# EAGLE design SCH Basis (EAGLE 9.6.2)
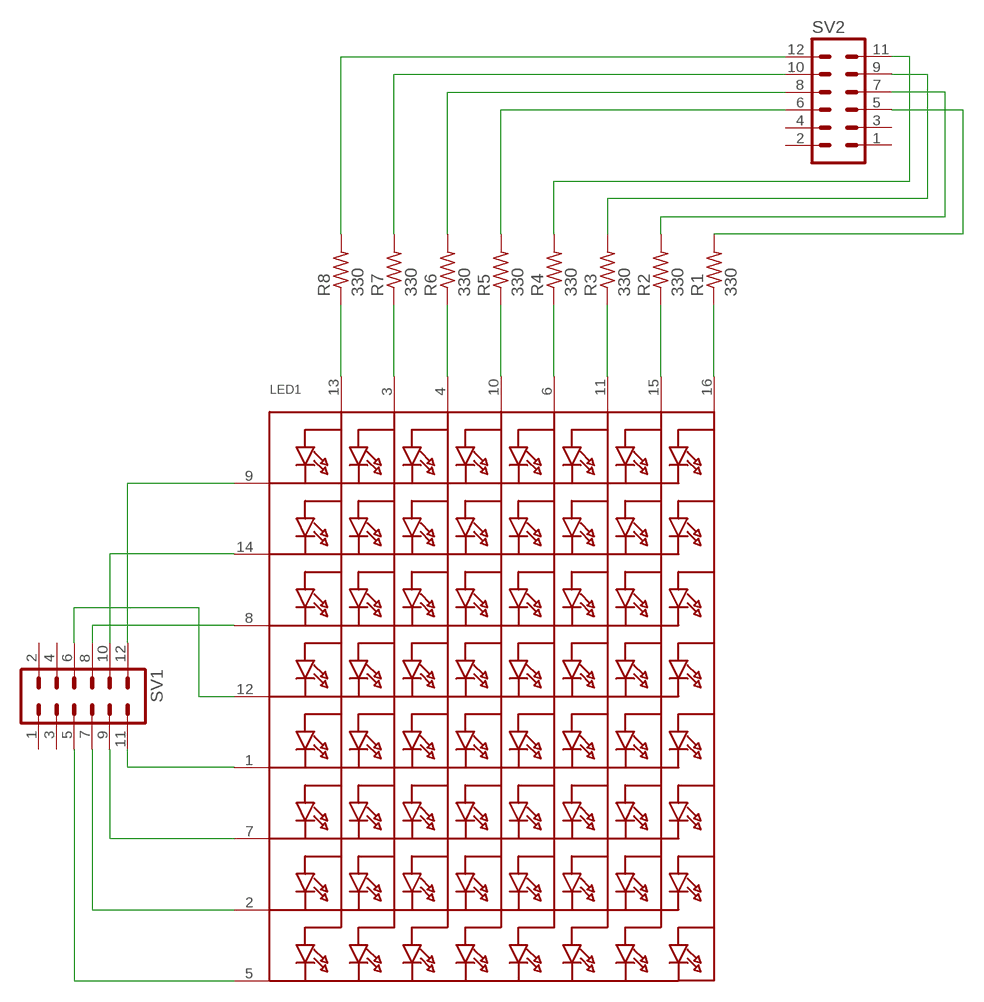
[diagram p0: schematic, sheet 1]

## Parts
LED1  SEGMENT_8X8_ROWCATHODEM12A881UR  [SEGMENT_BL-M12A881UR]
R1  330  R-US_0207/9  [0207/9]
R2  330  R-US_0207/9  [0207/9]
R3  330  R-US_0207/9  [0207/9]
R4  330  R-US_0207/9  [0207/9]
R5  330  R-US_0207/9  [0207/9]
R6  330  R-US_0207/9  [0207/9]
R7  330  R-US_0207/9  [0207/9]
R8  330  R-US_0207/9  [0207/9]
SV1  MA06-2  [MA06-2]
SV2  MA06-2  [MA06-2]

## Nets
N$1: LED1.13(A1) R8.1
N$2: LED1.3(A2) R7.1
N$3: LED1.4(A3) R6.1
N$4: LED1.10(A4) R5.1
N$5: LED1.6(A5) R4.1
N$6: LED1.11(A6) R3.1
N$7: LED1.15(A7) R2.1
N$8: LED1.16(A8) R1.1
N$9: R8.2 SV2.12
N$10: R7.2 SV2.10
N$11: R6.2 SV2.8
N$12: R5.2 SV2.6
N$13: R4.2 SV2.11
N$14: R3.2 SV2.9
N$15: R2.2 SV2.7
N$16: R1.2 SV2.5
N$17: LED1.9(K1) SV1.12
N$18: LED1.14(K2) SV1.10
N$19: LED1.8(K3) SV1.8
N$20: LED1.12(K4) SV1.6
N$21: LED1.1(K5) SV1.11
N$22: LED1.7(K6) SV1.9
N$23: LED1.2(K7) SV1.7
N$24: LED1.5(K8) SV1.5
Unconnected: SV1.1 SV1.2 SV1.3 SV1.4 SV2.1 SV2.2 SV2.3 SV2.4

## Library data of the parts
LED1 = adafruit:SEGMENT_8X8_ROWCATHODE: 8x8 LED Segment Displays: Row = Cathode 0.7" Red 8X8 Matrix, 1.9mm Round LEDs - BL-M07C881UR 1.2" Red 8x8 Matrix, 3.0mm Round LEDs - BL-M12A881UR 1.2" Red 8x8 Matrix, 3.0mm Square LEDs - BL-M12A883
R1-R8 = adafruit:R-US_: RESISTOR, American symbol
SV1 SV2 = con-lstb:MA06-2: PIN HEADER; OC_FARNELL: unknown; OC_NEWARK: unknown

## Board
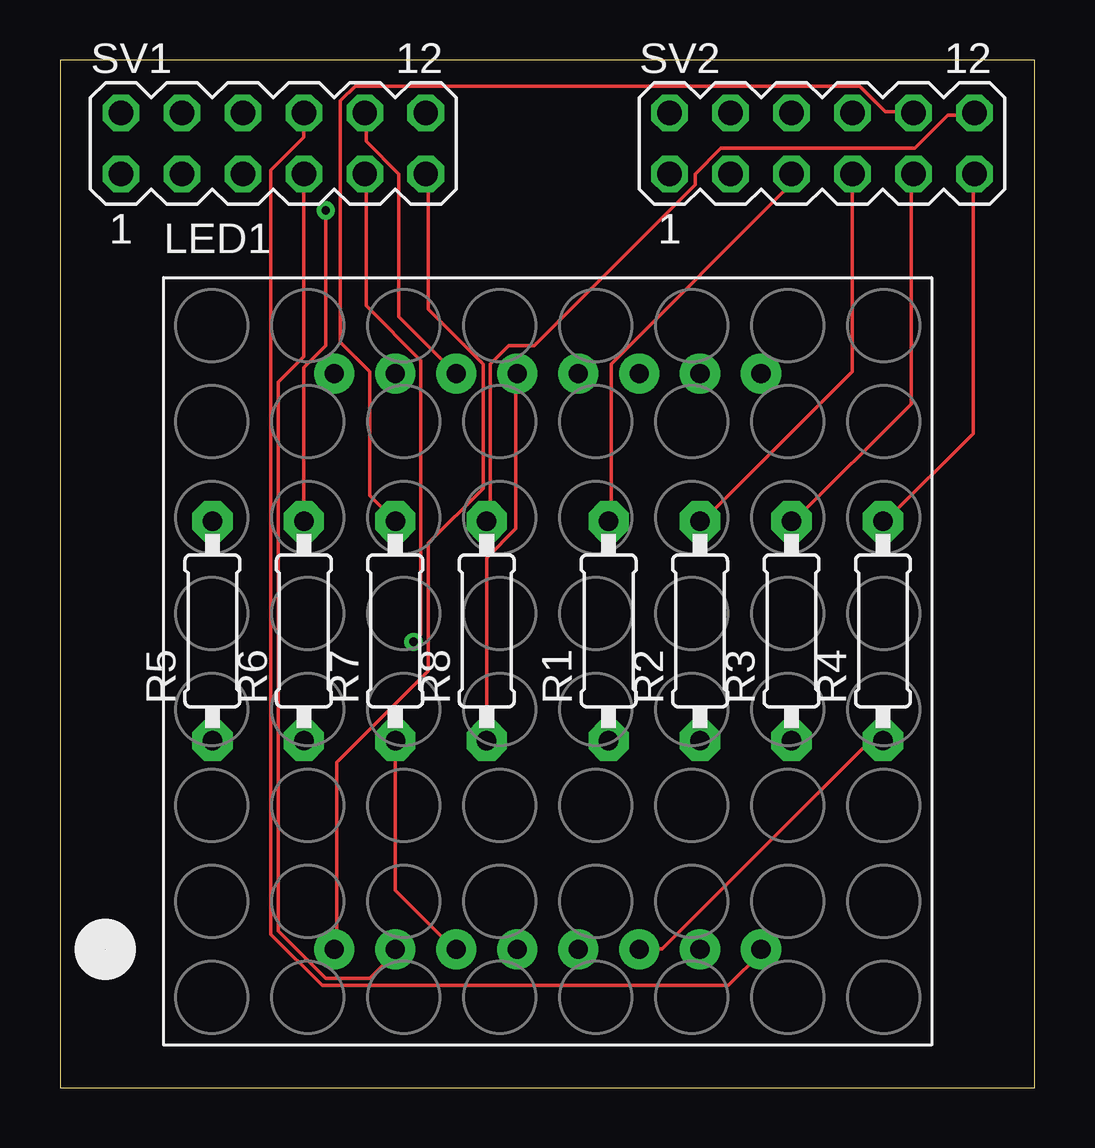
[diagram p1: board, top side]
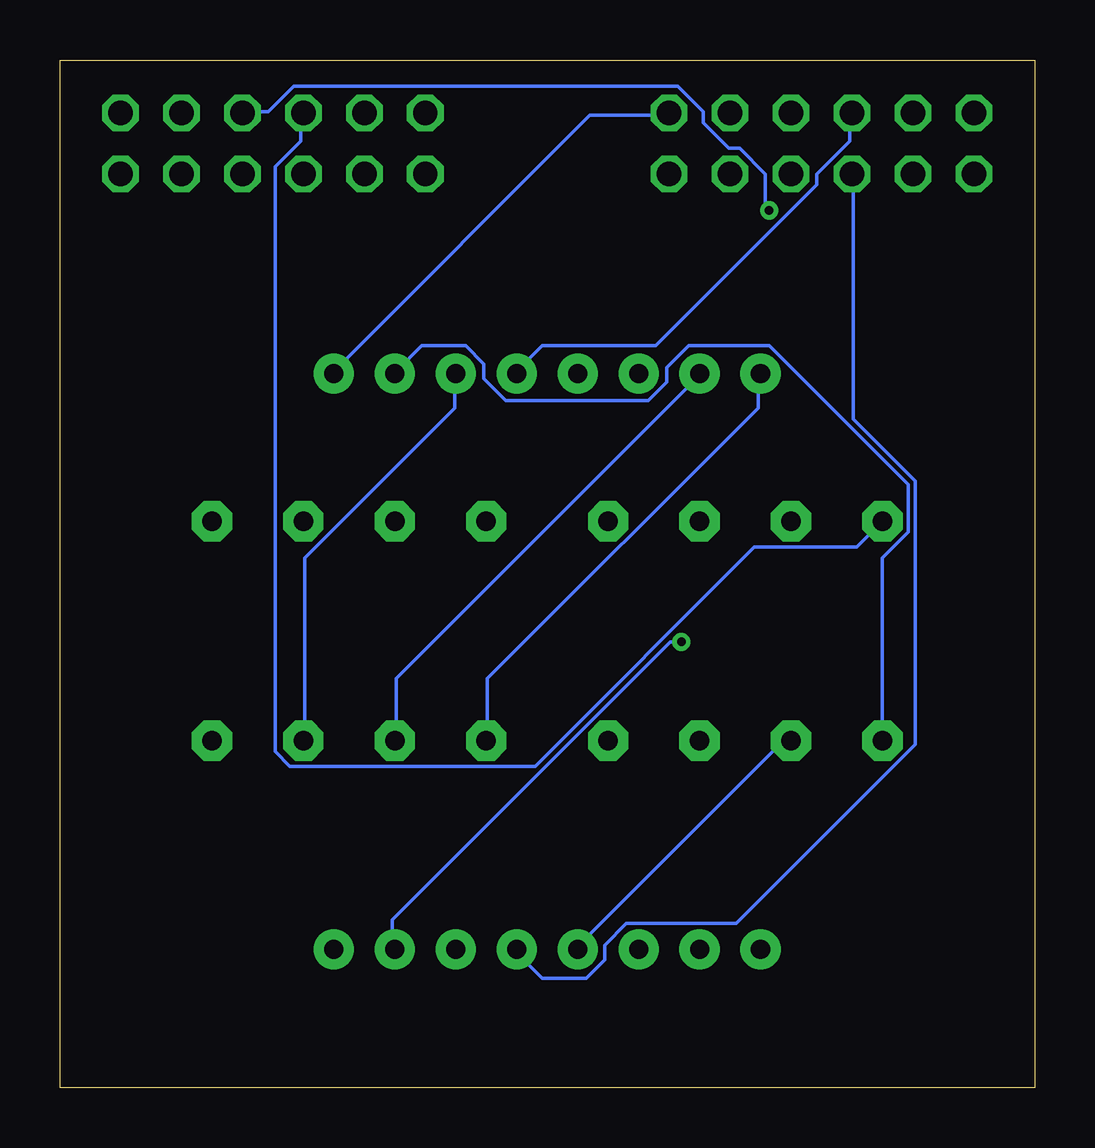
[diagram p2: board, bottom side, seen from below]

Size 40.62 x 42.85 mm. Coordinates in mm from the lower left corner, seen from the top.
Outline: 0,0 40.62,0 40.62,42.85 0,42.85 0,0
Copper layers (1*16): Top 0.035mm / dielectric 1.5mm / Bottom 0.035mm
Design rules "default": minimum track width 6mil, minimum drill 0.35mm, track to track 6mil, track to pad 6mil, pad to pad 6mil, via to via 6mil, smd to smd 6mil, copper to edge 40mil, drill to drill 6mil, minimum pad ring 10mil, minimum via ring 8mil, stop-mask expansion 4mil, vias tented up to drill 0mil, thermal gap 10mil

### Footprints (pad centres in the part's own frame; a part is rotated, then mirrored left to right if it is on the bottom)
SEGMENT_BL-M12A881UR = drill 0.8 pad 1.676: 1 -8.89,-12; 2 -6.35,-12; 3 -3.81,-12; 4 -1.27,-12; 5 1.27,-12; 6 3.81,-12; 7 6.35,-12; 8 8.89,-12; 9 8.89,12; 10 6.35,12; 11 3.81,12; 12 1.27,12; 13 -1.27,12; 14 -3.81,12; 15 -6.35,12; 16 -8.89,12
0207/9 = drill 0.813 pad 1.676 octagon: 1 -4.572,0; 2 4.572,0
MA06-2 = drill 1.016 octagon: 1 -6.35,-1.27; 2 -6.35,1.27; 3 -3.81,-1.27; 4 -3.81,1.27; 5 -1.27,-1.27; 6 -1.27,1.27; 7 1.27,-1.27; 8 1.27,1.27; 9 3.81,-1.27; 10 3.81,1.27; 11 6.35,-1.27; 12 6.35,1.27

### Placement (x,y rotation side)
LED1  20.32,17.78 0 top
R1  22.86,19.05 90 top
R2  26.67,19.05 90 top
R3  30.48,19.05 90 top
R4  34.29,19.05 90 top
R5  6.35,19.05 90 top
R6  10.16,19.05 90 top
R7  13.97,19.05 90 top
R8  17.78,19.05 90 top
SV1  8.89,39.37 0 top
SV2  31.75,39.37 0 top

### Tracks (layer width: path | path; a pad name or v marks a point on that pad's centre or on a via)
N$1
  Top 0.152: 19,29.82 LED1.13 19,29.72 19,23.32 17.78,22.1 R8.1
N$2
  Top 0.152: R7.1 13.97,8.23 16.41,5.79 LED1.3
  Bottom 0.152: 16.41,5.89 LED1.3
N$3
  Bottom 0.152: 19,5.89 LED1.4 19,5.94 10.46,14.48 R6.1
N$4
  Bottom 0.152: 26.62,29.82 LED1.10 26.62,29.87 25.55,30.94 23.72,30.94 22.96,30.18 22.96,29.57 22.05,28.65 16.1,28.65 15.34,29.41 15.34,30.02 14.43,30.94 11.07,30.94 5.28,25.15 5.28,23.16 6.35,22.1 R5.1
N$5
  Top 0.152: 24.03,5.89 LED1.6 24.18,5.79 25.09,5.79 33.78,14.48 R4.1
N$6
  Top 0.152: 24.18,29.82 LED1.11
  Bottom 0.152: R3.1 30.43,14.48 30.43,22.1 24.18,28.35 24.18,29.72 LED1.11
N$7
  Bottom 0.152: 13.97,29.67 13.97,29.72 | 13.97,29.72 26.62,17.07 26.62,14.48 R2.1 | 13.97,29.72 LED1.15
N$8
  Bottom 0.152: 11.53,29.82 LED1.16 11.53,29.72 11.53,28.35 22.81,17.07 22.81,14.48 R1.1
N$9
  Top 0.152: R8.2 17.93,23.77 17.93,30.18 18.69,30.94 19.76,30.94 26.47,37.64 26.47,38.1 27.53,39.17 35.61,39.17 36.98,40.54 38.05,40.54 SV2.12
N$10
  Top 0.152: R7.2 12.9,24.69 12.9,29.87 11.68,31.09 11.68,41.15 12.29,41.76 33.32,41.76 34.39,40.69 35.46,40.69 SV2.10
N$11  (via drill 0.35)
  Top 0.152: v11.07,36.58 11.07,30.94 10.16,30.02 R6.2
  Bottom 0.152: v11.07,36.58 11.23,36.73 11.23,38.1 12.29,39.17 12.75,39.17 13.82,40.23 13.82,40.69 14.88,41.76 30.89,41.76 31.95,40.69 33.02,40.69 SV2.8
N$12
  Bottom 0.152: R5.2 7.42,22.55 11.68,22.55 20.83,13.41 31.04,13.41 31.65,14.02 31.65,38.41 30.58,39.47 30.58,40.54 SV2.6
N$13
  Top 0.152: SV2.11 38.05,38.1 38.05,27.28 34.39,23.62 R4.2
N$14
  Top 0.152: SV2.9 35.46,38.1 35.46,28.5 30.58,23.62 R3.2
N$15
  Top 0.152: SV2.7 33.02,29.87 26.77,23.62 R2.2
N$16
  Top 0.152: SV2.5 30.43,38.1 30.43,37.64 22.96,30.18 22.96,23.62 R1.2
  Bottom 0.152: 30.58,38.1 SV2.5
N$17
  Bottom 0.152: SV1.12 15.34,40.54 18.54,40.54 29.21,29.87 LED1.9
N$18
  Top 0.152: 16.41,29.67 LED1.14 16.41,29.87 14.12,32.16 14.12,38.1 12.75,39.47 12.75,40.54 SV1.10
N$19
  Top 0.152: SV1.8 10.16,39.62 8.79,38.25 8.79,6.4 10.92,4.27 27.84,4.27 29.21,5.64 LED1.8
  Bottom 0.152: 10.16,40.54 SV1.8 | 29.21,5.74 LED1.8
N$20
  Bottom 0.152: SV1.6 7.72,40.54 7.72,39.47 9.09,38.1 9.09,37.64 15.8,30.94 20.52,30.94 21.59,29.87 LED1.12
N$21
  Top 0.152: SV1.11 15.34,38.1 15.34,32.46 17.63,30.18 17.63,24.99 15.34,22.71 15.34,17.37 11.53,13.56 11.53,5.79 LED1.1
  Bottom 0.152: 11.38,5.89 LED1.1
N$22  (via drill 0.35)
  Top 0.152: v14.73,18.59 15.04,18.9 15.04,30.33 12.75,32.61 12.75,38.1 SV1.9
  Bottom 0.152: 12.75,38.1 SV1.9 | 26.77,5.89 LED1.7 26.77,5.94 26.77,7.01 15.19,18.59 v14.73,18.59
N$23
  Top 0.152: SV1.7 10.16,30.48 9.09,29.41 9.09,6.55 11.07,4.57 12.9,4.57 13.97,5.64 LED1.2
  Bottom 0.152: 13.97,5.89 LED1.2
N$24
  Bottom 0.152: 21.59,5.74 LED1.5 21.59,5.64 20.52,4.57 18.69,4.57 17.93,5.33 17.93,5.94 17.02,6.86 12.45,6.86 4.98,14.33 4.98,25.3 7.57,27.89 7.57,38.1 SV1.5